# Altium schematic sheet CAN.SchDoc
size A; DocumentNumber: 4; SheetNumber: 5; SheetTotal: 9
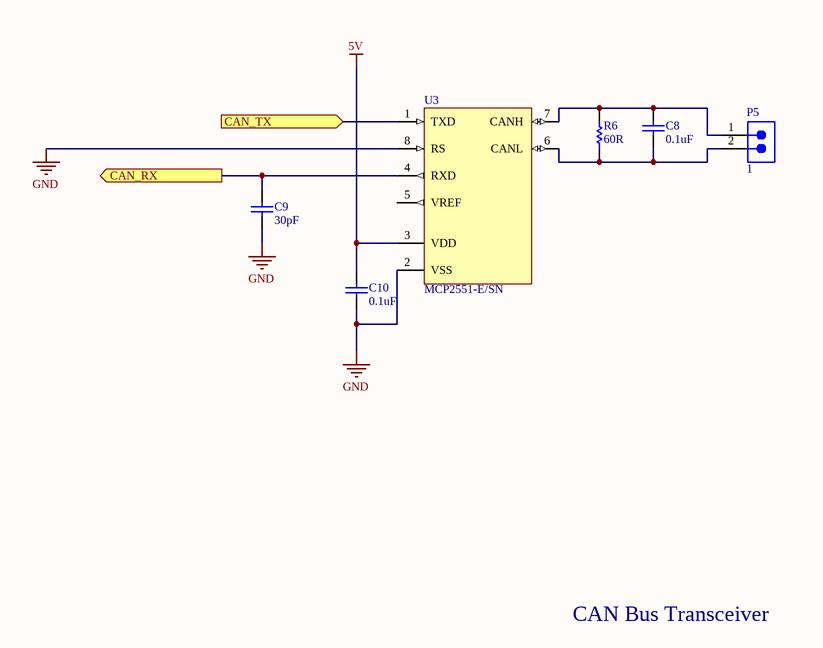
[diagram p0: CAN.SchDoc]

## Parts
C8  0.1uF  [CAPC1608X90X35LL15T15]
C9  30pF  [CAPC1608X87X35LL15T15]
C10  0.1uF  [CAPC1608X90X35LL15T15]
P5  1  [SMTC-DW-02-16-X-S-200]
R6  60R  [RESC1609X50X30NL10T20]
U3  MCP2551-E/SN  [SOIC-SN8_N]

## Ports
CAN_RX (out), CAN_TX (in)

## Nets
5V: C10.2 U3.3(VDD)
GND: C9.1 C10.1 U3.2(VSS) U3.8(RS)
CAN_RX: C9.2 U3.4(RXD) ; port CAN_RX
CAN_TX: U3.1(TXD) ; port CAN_TX
NetC8_1: C8.1 P5.2 R6.1 U3.6(CANL)
NetC8_2: C8.2 P5.1 R6.2 U3.7(CANH)

Not connected (* = marked no-connect by the designer): U3 5(VREF)

## Notes on the sheet
- CAN Bus Transceiver

## Library data of the parts
C8 C10 = CMP-2006-04389-2: Chip Capacitor, 100 nF, +/- 10%, 50 V, -55 to 125 degC, 0603 (1608 Metric), RoHS, Tape and Reel; Case\Package: 0603; Type (Capacitors): X7R; Capacitance: 100 nF; Voltage Rating: 50 V; Pins: 2; Max Operating Temperature: 125 degC; Min Operating Temperature: -55 degC; Case Code (Imperial): 0603; DatasheetVersion: 07/2016; Package Quantity: 4000; Length: 1.6 mm; REACH SVHC: No SVHC; Packaging: Tape and Reel; Case Code (Metric): 1608; Mounting Technology: Surface Mount; RoHSCompliant: true; Height: 0.9 mm; ComponentLink1URL: http://www.avx.com/; ComponentLink2URL: http://datasheets.avx.com/X7RDielectric.pdf; Mount: Surface Mount; ComponentLink2Description: Datasheet; Width: 0.81 mm; PackageReference: 0603; PackageDescription: 2-Pin Surface Mount Device, Body 1.6 x 0.81 mm; Radiation Hardening: No; ComponentLink1Description: Manufacturer URL; Voltage Rating (DC): 50 V; Tolerance: 10%
C9 = CMP-2006-03166-1: Manufacturer: Kemet; Part Number: C0603C300J5GACTU
P5 = CMP-1024-00001-1: Flexible .025" SQ Board Stacker, Through-hole, Vertical, -55 to 125 degC, 2.54 mm Pitch, 2-Pin, Male, RoHS; PartNumber: DW-02-16-G-S-200; Manufacturer: Samtec; Pitch: 2.54 mm; ComponentLink1Description: Manufacturer URL; ComponentLink3Description: Package Specification; DatasheetVersion: F-214; ComponentLink1URL: http://www.samtec.com; RoHS: True; PackageVersion: AX, 8/1984; ComponentLink2URL: http://www.samtec.com/documents/webfiles/pdf/DW.PDF; ComponentLink2Description: Datasheet; Orientation: Vertical; PackageReference: DW-02-16-X-S-200; PackageDescription: Low Cost Board Spacer; ComponentLink3URL: http://www.samtec.com/documents/webfiles/cpdf/XW-XX-XX-XXX-X-XXXX-XXX-XX-XXX-MKT1.PDF; Mounting Technology: Through-hole; Temperature Range: -55 to 125 degC
R6 = CMP-2000-03838-1: Manufacturer: Vishay Dale; Part Number: CRCW060310K0JNEA
U3 = CMP-0186-00038-2: High-Speed CAN Transceiver, 8-Pin SOIC, Extended Temperature; PackageReference: SOIC-SN8; Code_JEDEC: MS-012; ComponentLink1Description: Manufacturer URL; ComponentLink1URL: http://www.microchip.com/; PackageVersion: revBB, Aug-2009; ComponentLink3Description: Package Specification; Code_IPC: SOIC127P600-8; ComponentLink2URL: http://ww1.microchip.com/downloads/en/DeviceDoc/21667F.pdf; RevisionNote: URLs added. DatasheetVersion updated.; ComponentLink3URL: http://www.microchip.com/stellent/groups/techpub_sg/documents/packagingspec/en012702.pdf; DatasheetVersion: revF, Jul-2010; ComponentLink2Description: Datasheet; PackageDescription: 8-Lead Plastic Small Outline (SN) - Narrow, 3.90mm Body [SOIC]